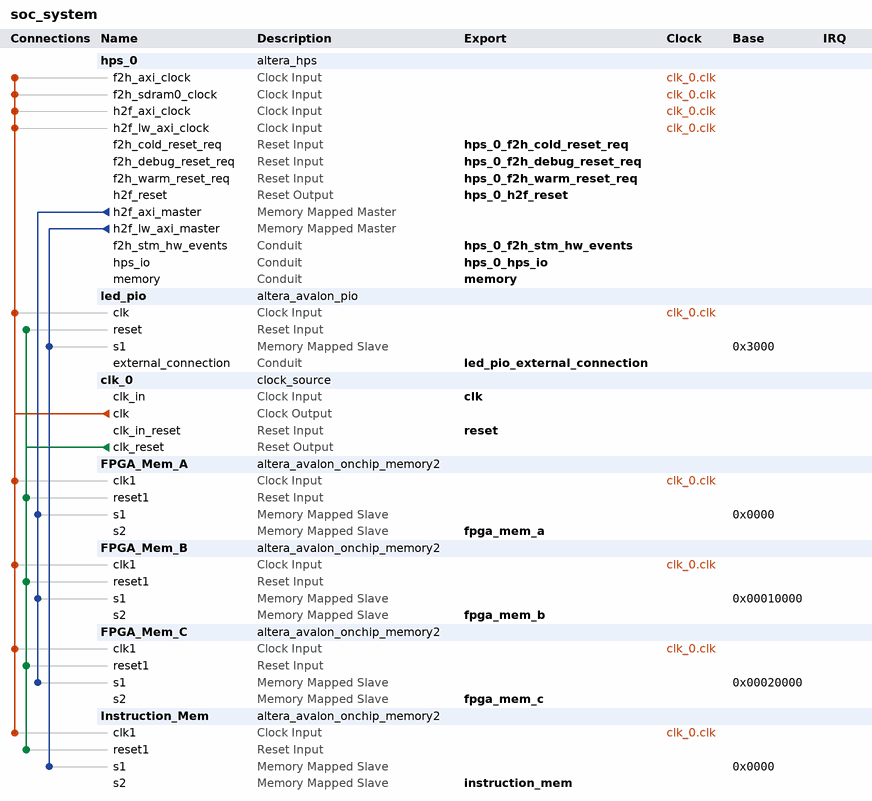
[diagram p0: system contents]
# Platform Designer (Qsys) system soc_system, Cyclone V 5CSXFC6D6F31C6
# Parameters at their usual value, and those the tool derives, are not listed.
package require -exact qsys 16.1
create_system soc_system
set_project_property DEVICE_FAMILY {Cyclone V}
set_project_property DEVICE 5CSXFC6D6F31C6

add_instance hps_0 altera_hps 16.1
set_instance_parameter_value hps_0 EMAC1_Mode RGMII
set_instance_parameter_value hps_0 EMAC1_PinMuxing {HPS I/O Set 0}
set_instance_parameter_value hps_0 F2SCLK_COLDRST_Enable true
set_instance_parameter_value hps_0 F2SCLK_DBGRST_Enable true
set_instance_parameter_value hps_0 F2SCLK_WARMRST_Enable true
set_instance_parameter_value hps_0 F2SDRAM_Type {Avalon-MM Bidirectional}
set_instance_parameter_value hps_0 F2SDRAM_Width 256
set_instance_parameter_value hps_0 F2SINTERRUPT_Enable true
set_instance_parameter_value hps_0 F2S_Width 3
set_instance_parameter_value hps_0 FPGA_PERIPHERAL_OUTPUT_CLOCK_FREQ_EMAC0_GTX_CLK 100
set_instance_parameter_value hps_0 FPGA_PERIPHERAL_OUTPUT_CLOCK_FREQ_EMAC0_MD_CLK 100.0
set_instance_parameter_value hps_0 FPGA_PERIPHERAL_OUTPUT_CLOCK_FREQ_EMAC1_GTX_CLK 100
set_instance_parameter_value hps_0 FPGA_PERIPHERAL_OUTPUT_CLOCK_FREQ_EMAC1_MD_CLK 100.0
set_instance_parameter_value hps_0 HPS_PROTOCOL DDR3
set_instance_parameter_value hps_0 I2C0_Mode I2C
set_instance_parameter_value hps_0 I2C0_PinMuxing {HPS I/O Set 0}
set_instance_parameter_value hps_0 I2C1_Mode I2C
set_instance_parameter_value hps_0 I2C1_PinMuxing {HPS I/O Set 0}
set_instance_parameter_value hps_0 LWH2F_Enable true
set_instance_parameter_value hps_0 MEM_BANKADDR_WIDTH 3
set_instance_parameter_value hps_0 MEM_CLK_FREQ 400.0
set_instance_parameter_value hps_0 MEM_COL_ADDR_WIDTH 10
set_instance_parameter_value hps_0 MEM_DQ_WIDTH 32
set_instance_parameter_value hps_0 MEM_DRV_STR RZQ/6
set_instance_parameter_value hps_0 MEM_ROW_ADDR_WIDTH 15
set_instance_parameter_value hps_0 MEM_RTT_NOM RZQ/6
set_instance_parameter_value hps_0 MEM_RTT_WR {Dynamic ODT off}
set_instance_parameter_value hps_0 MEM_TCL 11
set_instance_parameter_value hps_0 MEM_TFAW_NS 45.0
set_instance_parameter_value hps_0 MEM_TRAS_NS 35.0
set_instance_parameter_value hps_0 MEM_TRCD_NS 13.75
set_instance_parameter_value hps_0 MEM_TRFC_NS 260.0
set_instance_parameter_value hps_0 MEM_TRP_NS 13.75
set_instance_parameter_value hps_0 MEM_VENDOR Micron
set_instance_parameter_value hps_0 MEM_WTCL 7
set_instance_parameter_value hps_0 QSPI_Mode {1 SS}
set_instance_parameter_value hps_0 QSPI_PinMuxing {HPS I/O Set 0}
set_instance_parameter_value hps_0 REF_CLK_FREQ 25.0
set_instance_parameter_value hps_0 S2FCLK_USER2CLK 5
set_instance_parameter_value hps_0 S2F_Width 3
set_instance_parameter_value hps_0 SDIO_Mode {4-bit Data}
set_instance_parameter_value hps_0 SDIO_PinMuxing {HPS I/O Set 0}
set_instance_parameter_value hps_0 SPIM0_Mode {Single Slave Select}
set_instance_parameter_value hps_0 SPIM0_PinMuxing {HPS I/O Set 0}
set_instance_parameter_value hps_0 SPIM1_Mode {Single Slave Select}
set_instance_parameter_value hps_0 SPIM1_PinMuxing {HPS I/O Set 0}
set_instance_parameter_value hps_0 STM_Enable true
set_instance_parameter_value hps_0 TIMING_BOARD_AC_SKEW 0.02
set_instance_parameter_value hps_0 TIMING_BOARD_AC_TO_CK_SKEW 0.01
set_instance_parameter_value hps_0 TIMING_BOARD_DQ_TO_DQS_SKEW 0.05
set_instance_parameter_value hps_0 TIMING_BOARD_MAX_CK_DELAY 0.03
set_instance_parameter_value hps_0 TIMING_BOARD_MAX_DQS_DELAY 0.02
set_instance_parameter_value hps_0 TIMING_BOARD_SKEW_BETWEEN_DQS 0.06
set_instance_parameter_value hps_0 TIMING_BOARD_SKEW_CKDQS_DIMM_MAX 0.12
set_instance_parameter_value hps_0 TIMING_BOARD_SKEW_CKDQS_DIMM_MIN 0.06
set_instance_parameter_value hps_0 TIMING_BOARD_SKEW_WITHIN_DQS 0.01
set_instance_parameter_value hps_0 TIMING_TDH 65
set_instance_parameter_value hps_0 TIMING_TDQSCK 255
set_instance_parameter_value hps_0 TIMING_TDQSQ 125
set_instance_parameter_value hps_0 TIMING_TDS 30
set_instance_parameter_value hps_0 TIMING_TIH 140
set_instance_parameter_value hps_0 TIMING_TIS 190
set_instance_parameter_value hps_0 TIMING_TQSH 0.4
set_instance_parameter_value hps_0 UART0_Mode {No Flow Control}
set_instance_parameter_value hps_0 UART0_PinMuxing {HPS I/O Set 0}
set_instance_parameter_value hps_0 USB1_Mode SDR
set_instance_parameter_value hps_0 USB1_PinMuxing {HPS I/O Set 0}
set_instance_parameter_value hps_0 desired_cfg_clk_mhz 100.0
set_instance_parameter_value hps_0 desired_qspi_clk_mhz 400.0

add_instance led_pio altera_avalon_pio 16.1
set_instance_parameter_value led_pio direction Output
set_instance_parameter_value led_pio width 10

add_instance clk_0 clock_source 16.1
set_instance_parameter_value clk_0 clockFrequency 50000000

add_instance FPGA_Mem_A altera_avalon_onchip_memory2 16.1
set_instance_parameter_value FPGA_Mem_A blockType M10K
set_instance_parameter_value FPGA_Mem_A dataWidth 128
set_instance_parameter_value FPGA_Mem_A dualPort true
set_instance_parameter_value FPGA_Mem_A enableDiffWidth true
set_instance_parameter_value FPGA_Mem_A initMemContent true
set_instance_parameter_value FPGA_Mem_A initializationFileName onchip_mem.hex
set_instance_parameter_value FPGA_Mem_A memorySize 65536
set_instance_parameter_value FPGA_Mem_A readDuringWriteMode OLD_DATA
set_instance_parameter_value FPGA_Mem_A singleClockOperation true

add_instance FPGA_Mem_B altera_avalon_onchip_memory2 16.1
set_instance_parameter_value FPGA_Mem_B blockType M10K
set_instance_parameter_value FPGA_Mem_B dataWidth 128
set_instance_parameter_value FPGA_Mem_B dualPort true
set_instance_parameter_value FPGA_Mem_B enableDiffWidth true
set_instance_parameter_value FPGA_Mem_B initMemContent true
set_instance_parameter_value FPGA_Mem_B initializationFileName onchip_mem.hex
set_instance_parameter_value FPGA_Mem_B memorySize 65536
set_instance_parameter_value FPGA_Mem_B readDuringWriteMode OLD_DATA
set_instance_parameter_value FPGA_Mem_B singleClockOperation true

add_instance FPGA_Mem_C altera_avalon_onchip_memory2 16.1
set_instance_parameter_value FPGA_Mem_C blockType M10K
set_instance_parameter_value FPGA_Mem_C dataWidth 128
set_instance_parameter_value FPGA_Mem_C dualPort true
set_instance_parameter_value FPGA_Mem_C enableDiffWidth true
set_instance_parameter_value FPGA_Mem_C initMemContent true
set_instance_parameter_value FPGA_Mem_C initializationFileName onchip_mem.hex
set_instance_parameter_value FPGA_Mem_C memorySize 65536
set_instance_parameter_value FPGA_Mem_C readDuringWriteMode OLD_DATA
set_instance_parameter_value FPGA_Mem_C singleClockOperation true

add_instance Instruction_Mem altera_avalon_onchip_memory2 16.1
set_instance_parameter_value Instruction_Mem blockType M10K
set_instance_parameter_value Instruction_Mem dataWidth 32
set_instance_parameter_value Instruction_Mem dualPort true
set_instance_parameter_value Instruction_Mem initMemContent true
set_instance_parameter_value Instruction_Mem initializationFileName onchip_mem.hex
set_instance_parameter_value Instruction_Mem memorySize 4096
set_instance_parameter_value Instruction_Mem readDuringWriteMode OLD_DATA
set_instance_parameter_value Instruction_Mem singleClockOperation true

# connections
add_connection clk_0.clk FPGA_Mem_A.clk1 clock
add_connection clk_0.clk FPGA_Mem_B.clk1 clock
add_connection clk_0.clk FPGA_Mem_C.clk1 clock
add_connection clk_0.clk hps_0.f2h_axi_clock clock
add_connection clk_0.clk hps_0.f2h_sdram0_clock clock
add_connection clk_0.clk hps_0.h2f_axi_clock clock
add_connection clk_0.clk hps_0.h2f_lw_axi_clock clock
add_connection clk_0.clk Instruction_Mem.clk1 clock
add_connection clk_0.clk led_pio.clk clock
add_connection clk_0.clk_reset FPGA_Mem_A.reset1 reset
add_connection clk_0.clk_reset FPGA_Mem_B.reset1 reset
add_connection clk_0.clk_reset FPGA_Mem_C.reset1 reset
add_connection clk_0.clk_reset Instruction_Mem.reset1 reset
add_connection clk_0.clk_reset led_pio.reset reset
add_connection hps_0.h2f_axi_master FPGA_Mem_A.s1 avalon
set_connection_parameter_value hps_0.h2f_axi_master/FPGA_Mem_A.s1 baseAddress 0x0000
add_connection hps_0.h2f_axi_master FPGA_Mem_B.s1 avalon
set_connection_parameter_value hps_0.h2f_axi_master/FPGA_Mem_B.s1 baseAddress 0x00010000
add_connection hps_0.h2f_axi_master FPGA_Mem_C.s1 avalon
set_connection_parameter_value hps_0.h2f_axi_master/FPGA_Mem_C.s1 baseAddress 0x00020000
add_connection hps_0.h2f_lw_axi_master Instruction_Mem.s1 avalon
set_connection_parameter_value hps_0.h2f_lw_axi_master/Instruction_Mem.s1 baseAddress 0x0000
add_connection hps_0.h2f_lw_axi_master led_pio.s1 avalon
set_connection_parameter_value hps_0.h2f_lw_axi_master/led_pio.s1 baseAddress 0x3000

# exported interfaces
add_interface clk clock sink
set_interface_property clk EXPORT_OF clk_0.clk_in
add_interface fpga_mem_a avalon slave
set_interface_property fpga_mem_a EXPORT_OF FPGA_Mem_A.s2
add_interface fpga_mem_b avalon slave
set_interface_property fpga_mem_b EXPORT_OF FPGA_Mem_B.s2
add_interface fpga_mem_c avalon slave
set_interface_property fpga_mem_c EXPORT_OF FPGA_Mem_C.s2
add_interface hps_0_f2h_cold_reset_req reset sink
set_interface_property hps_0_f2h_cold_reset_req EXPORT_OF hps_0.f2h_cold_reset_req
add_interface hps_0_f2h_debug_reset_req reset sink
set_interface_property hps_0_f2h_debug_reset_req EXPORT_OF hps_0.f2h_debug_reset_req
add_interface hps_0_f2h_stm_hw_events conduit end
set_interface_property hps_0_f2h_stm_hw_events EXPORT_OF hps_0.f2h_stm_hw_events
add_interface hps_0_f2h_warm_reset_req reset sink
set_interface_property hps_0_f2h_warm_reset_req EXPORT_OF hps_0.f2h_warm_reset_req
add_interface hps_0_h2f_reset reset source
set_interface_property hps_0_h2f_reset EXPORT_OF hps_0.h2f_reset
add_interface hps_0_hps_io conduit end
set_interface_property hps_0_hps_io EXPORT_OF hps_0.hps_io
add_interface instruction_mem avalon slave
set_interface_property instruction_mem EXPORT_OF Instruction_Mem.s2
add_interface led_pio_external_connection conduit end
set_interface_property led_pio_external_connection EXPORT_OF led_pio.external_connection
add_interface memory conduit end
set_interface_property memory EXPORT_OF hps_0.memory
add_interface reset reset sink
set_interface_property reset EXPORT_OF clk_0.clk_in_reset

set_interconnect_requirement {$system} qsys_mm.clockCrossingAdapter HANDSHAKE
set_interconnect_requirement {$system} qsys_mm.maxAdditionalLatency 1

save_system soc_system.qsys
